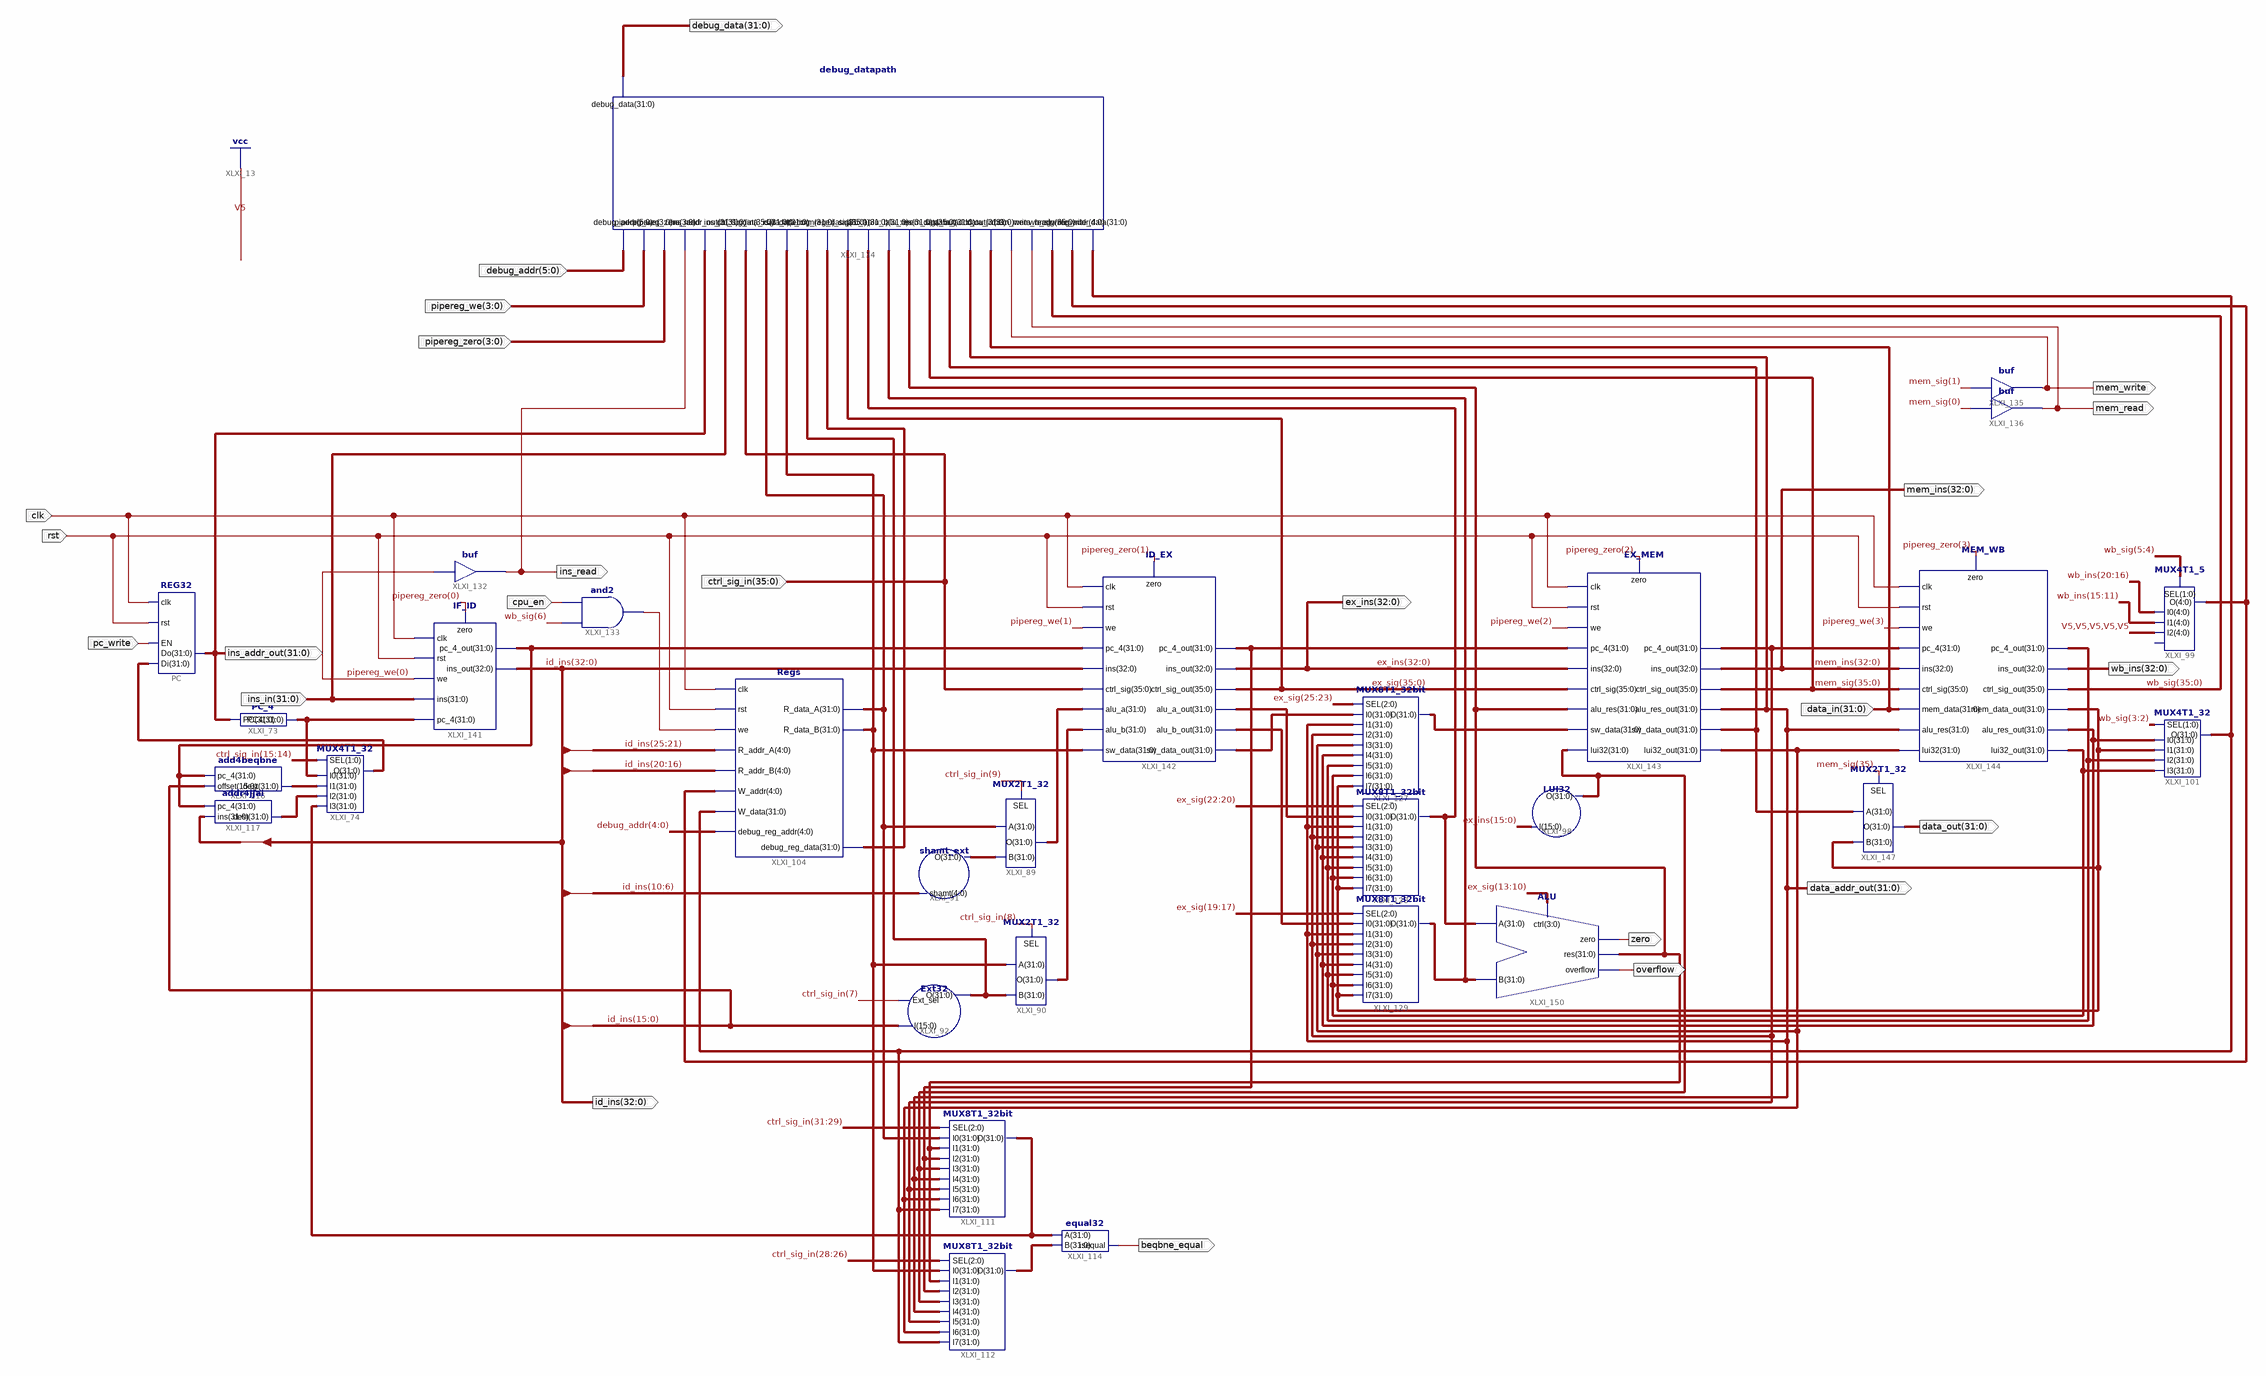
[diagram p0: schematic sheet 1]
// Xilinx ISE schematic Datapath_adv.sch (kintex7) as structural Verilog: 30 symbols, 24 ports
module Datapath_adv (
  input  [31:0] ins_in,
  input  rst,
  input  pc_write,
  input  [35:0] ctrl_sig_in,
  input  cpu_en,
  input  [5:0] debug_addr,
  input  [3:0] pipereg_we,
  input  [3:0] pipereg_zero,
  input  clk,
  input  [31:0] data_in,
  output [31:0] ins_addr_out,
  output [32:0] id_ins,
  output [32:0] ex_ins,
  output [32:0] mem_ins,
  output [31:0] data_addr_out,
  output zero,
  output overflow,
  output [32:0] wb_ins,
  output beqbne_equal,
  output ins_read,
  output [31:0] debug_data,
  output mem_write,
  output mem_read,
  output [31:0] data_out
);

  wire XLXN_590;
  wire [4:0] XLXN_380;
  wire [31:0] t, wb_mem_data_out, XLXN_301, XLXN_308, XLXN_314, XLXN_315, XLXN_336, XLXN_337, XLXN_390,
       XLXN_403, XLXN_404, XLXN_405, XLXN_500, XLXN_501, XLXN_502, XLXN_503, XLXN_506, XLXN_507, XLXN_508,
       XLXN_510, XLXN_512, XLXN_516, XLXN_570, XLXN_581, XLXN_583, XLXN_605, XLXN_606, XLXN_621, XLXN_628,
       XLXN_649, XLXN_656;
  wire [35:0] ex_sig, mem_sig, wb_sig;

  REG32 PC (.clk(clk), .rst(rst), .EN(pc_write), .Di(XLXN_301), .Do(ins_addr_out));
  PC_4 XLXI_73 (.PC(ins_addr_out), .PC4(XLXN_512));
  MUX4T1_32 XLXI_74 (
    .I3(XLXN_500), .I2(XLXN_516), .I1(XLXN_510), .I0(XLXN_512), .O(XLXN_301), .SEL(ctrl_sig_in[15:14]));
  MUX2T1_32 XLXI_89 (.SEL(ctrl_sig_in[9]), .A(XLXN_606), .B(XLXN_337), .O(XLXN_314));
  MUX2T1_32 XLXI_90 (.SEL(ctrl_sig_in[8]), .A(XLXN_501), .B(XLXN_336), .O(XLXN_315));
  shamt_ext XLXI_91 (.O(XLXN_337), .shamt(id_ins[10:6]));
  Ext32 XLXI_92 (.O(XLXN_336), .I(id_ins[15:0]), .Ext_sel(ctrl_sig_in[7]));
  MUX4T1_32 XLXI_101 (
    .I3(XLXN_403), .I2(XLXN_404), .I1(wb_mem_data_out), .I0(XLXN_405), .O(XLXN_570), .SEL(wb_sig[3:2]));
  MUX4T1_5 XLXI_99 (
    .I2({5{1'b1}}), .I1(wb_ins[15:11]), .I0(wb_ins[20:16]), .O(XLXN_380), .SEL(wb_sig[5:4]));  // open: I3
  Regs XLXI_104 (
    .clk(clk), .rst(rst), .we(XLXN_590), .R_addr_A(id_ins[25:21]), .R_addr_B(id_ins[20:16]),
    .W_addr(XLXN_380), .W_data(XLXN_570), .R_data_A(XLXN_606), .R_data_B(XLXN_501),
    .debug_reg_addr(debug_addr[4:0]), .debug_reg_data(XLXN_605));
  LUI32 XLXI_98 (.I(ex_ins[15:0]), .O(XLXN_621));
  MUX8T1_32bit XLXI_112 (
    .SEL(ctrl_sig_in[28:26]), .I0(XLXN_501), .I1(XLXN_502), .I2(XLXN_503), .I3(XLXN_621), .I4(data_addr_out),
    .I5(XLXN_506), .I6(XLXN_507), .I7(XLXN_570), .O(XLXN_508));
  MUX8T1_32bit XLXI_111 (
    .SEL(ctrl_sig_in[31:29]), .I0(XLXN_606), .I1(XLXN_502), .I2(XLXN_503), .I3(XLXN_621), .I4(data_addr_out),
    .I5(XLXN_506), .I6(XLXN_507), .I7(XLXN_570), .O(XLXN_500));
  equal32 XLXI_114 (.A(XLXN_500), .B(XLXN_508), .isequal(beqbne_equal));
  add4beqbne XLXI_116 (.pc_4(XLXN_308), .offset(id_ins[15:0]), .dest(XLXN_510));
  addr4jjal XLXI_117 (.pc_4(XLXN_308), .ins(id_ins[31:0]), .dest(XLXN_516));
  MUX8T1_32bit XLXI_127 (
    .SEL(ex_sig[25:23]), .I0(XLXN_583), .I1(data_addr_out), .I2(XLXN_506), .I3(XLXN_507), .I4(XLXN_405),
    .I5(XLXN_404), .I6(XLXN_403), .I7(wb_mem_data_out), .O(XLXN_656));
  MUX8T1_32bit XLXI_128 (
    .SEL(ex_sig[22:20]), .I0(XLXN_581), .I1(data_addr_out), .I2(XLXN_506), .I3(XLXN_507), .I4(XLXN_405),
    .I5(XLXN_404), .I6(XLXN_403), .I7(wb_mem_data_out), .O(XLXN_628));
  MUX8T1_32bit XLXI_129 (
    .SEL(ex_sig[19:17]), .I0(XLXN_390), .I1(data_addr_out), .I2(XLXN_506), .I3(XLXN_507), .I4(XLXN_405),
    .I5(XLXN_404), .I6(XLXN_403), .I7(wb_mem_data_out), .O(XLXN_649));
  buf XLXI_132 (ins_read, pipereg_we[0]);
  and XLXI_133 (XLXN_590, wb_sig[6], cpu_en);
  debug_datapath XLXI_134 (
    .debug_data(debug_data), .debug_addr(debug_addr), .pipereg_we(pipereg_we), .pipereg_zero(pipereg_zero),
    .ins_read(ins_read), .ins_in(ins_in), .ctrl_sig_in(ctrl_sig_in), .data_rs(XLXN_606), .data_rt(XLXN_501),
    .data_imm(XLXN_336), .mem_sig(mem_sig), .ex_sig(ex_sig), .alu_a(XLXN_628), .alu_b(XLXN_649),
    .alu_res(XLXN_502), .debug_reg_data(XLXN_605), .data_out(t), .data_addr_out(data_addr_out),
    .data_in(data_in), .mem_write(mem_write), .mem_read(mem_read), .wb_sig(wb_sig), .regwrite_addr(XLXN_380),
    .regwrite_data(XLXN_570), .ins_addr_out(ins_addr_out));
  buf XLXI_135 (mem_write, mem_sig[1]);
  buf XLXI_136 (mem_read, mem_sig[0]);
  IF_ID XLXI_141 (
    .clk(clk), .rst(rst), .we(pipereg_we[0]), .pc_4_out(XLXN_308), .ins_out(id_ins), .ins(ins_in),
    .pc_4(XLXN_512), .zero(pipereg_zero[0]));
  ID_EX XLXI_142 (
    .clk(clk), .rst(rst), .we(pipereg_we[1]), .pc_4(XLXN_308), .ins(id_ins), .ctrl_sig(ctrl_sig_in),
    .alu_a(XLXN_314), .alu_b(XLXN_315), .alu_b_out(XLXN_390), .alu_a_out(XLXN_581), .ctrl_sig_out(ex_sig),
    .ins_out(ex_ins), .pc_4_out(XLXN_503), .sw_data_out(XLXN_583), .sw_data(XLXN_501), .zero(pipereg_zero[1]));
  EX_MEM XLXI_143 (
    .clk(clk), .rst(rst), .we(pipereg_we[2]), .pc_4(XLXN_503), .ins(ex_ins), .ctrl_sig(ex_sig),
    .alu_res(XLXN_502), .alu_res_out(data_addr_out), .ctrl_sig_out(mem_sig), .ins_out(mem_ins),
    .pc_4_out(XLXN_506), .sw_data(XLXN_656), .sw_data_out(t), .lui32(XLXN_621), .lui32_out(XLXN_507),
    .zero(pipereg_zero[2]));
  MEM_WB XLXI_144 (
    .clk(clk), .rst(rst), .we(pipereg_we[3]), .pc_4(XLXN_506), .ins(mem_ins), .ctrl_sig(mem_sig),
    .mem_data(data_in), .mem_data_out(wb_mem_data_out), .ctrl_sig_out(wb_sig), .pc_4_out(XLXN_404),
    .ins_out(wb_ins), .alu_res(data_addr_out), .alu_res_out(XLXN_405), .lui32(XLXN_507),
    .lui32_out(XLXN_403), .zero(pipereg_zero[3]));
  ALU XLXI_150 (.ctrl(ex_sig[13:10]), .A(XLXN_628), .B(XLXN_649), .zero(zero), .res(XLXN_502), .overflow(overflow));
  MUX2T1_32 XLXI_147 (.SEL(mem_sig[35]), .A(t), .B(wb_mem_data_out), .O(data_out));
endmodule
